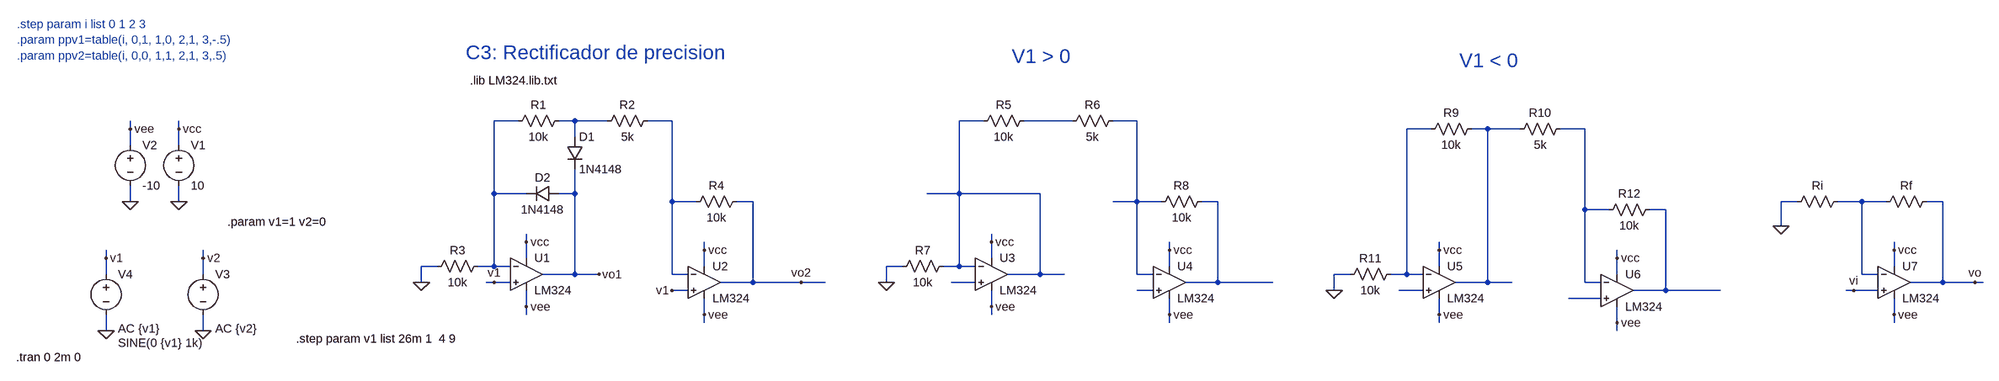
[diagram p0: schematic c3Rectificador.asc]
c3Rectificador.asc, the LTspice schematic file:
Version 4
SHEET 1 3476 680
WIRE 352 -240 304 -240
WIRE 464 -240 432 -240
WIRE 528 -240 464 -240
WIRE 656 -240 608 -240
WIRE 1296 -240 1248 -240
WIRE 1472 -240 1376 -240
WIRE 1600 -240 1552 -240
WIRE -416 -224 -416 -240
WIRE -320 -224 -320 -240
WIRE 2272 -224 2224 -224
WIRE 2384 -224 2352 -224
WIRE 2448 -224 2384 -224
WIRE 2576 -224 2528 -224
WIRE 464 -208 464 -240
WIRE -416 -192 -416 -224
WIRE -320 -192 -320 -224
WIRE 304 -96 304 -240
WIRE 368 -96 304 -96
WIRE 464 -96 464 -144
WIRE 464 -96 432 -96
WIRE 1248 -96 1248 -240
WIRE 1248 -96 1184 -96
WIRE 1408 -96 1248 -96
WIRE -416 -80 -416 -112
WIRE -320 -80 -320 -112
WIRE 656 -80 656 -240
WIRE 704 -80 656 -80
WIRE 816 -80 784 -80
WIRE 1600 -80 1600 -240
WIRE 1600 -80 1552 -80
WIRE 1648 -80 1600 -80
WIRE 1760 -80 1728 -80
WIRE 3040 -80 3008 -80
WIRE 3168 -80 3120 -80
WIRE 3216 -80 3168 -80
WIRE 3328 -80 3296 -80
WIRE 2576 -64 2576 -224
WIRE 2624 -64 2576 -64
WIRE 2736 -64 2704 -64
WIRE 3008 -32 3008 -80
WIRE 368 0 368 -16
WIRE 1312 0 1312 -16
WIRE 720 16 720 0
WIRE 1664 16 1664 0
WIRE 2288 16 2288 0
WIRE 3232 16 3232 0
WIRE -464 32 -464 16
WIRE -272 32 -272 16
WIRE 368 32 368 0
WIRE 1312 32 1312 0
WIRE 2640 32 2640 16
WIRE 192 48 160 48
WIRE 304 48 304 -96
WIRE 304 48 272 48
WIRE 336 48 304 48
WIRE 720 48 720 16
WIRE 1136 48 1104 48
WIRE 1248 48 1248 -96
WIRE 1248 48 1216 48
WIRE 1280 48 1248 48
WIRE 1664 48 1664 16
WIRE 2288 48 2288 16
WIRE 3232 48 3232 16
WIRE -464 64 -464 32
WIRE -272 64 -272 32
WIRE 464 64 464 -96
WIRE 464 64 400 64
WIRE 512 64 464 64
WIRE 656 64 656 -80
WIRE 688 64 656 64
WIRE 1408 64 1408 -96
WIRE 1408 64 1344 64
WIRE 1456 64 1408 64
WIRE 1600 64 1600 -80
WIRE 1632 64 1600 64
WIRE 2112 64 2080 64
WIRE 2224 64 2224 -224
WIRE 2224 64 2192 64
WIRE 2256 64 2224 64
WIRE 2640 64 2640 32
WIRE 3168 64 3168 -80
WIRE 3200 64 3168 64
WIRE 160 80 160 48
WIRE 304 80 288 80
WIRE 336 80 304 80
WIRE 816 80 816 -80
WIRE 816 80 752 80
WIRE 912 80 816 80
WIRE 960 80 912 80
WIRE 1104 80 1104 48
WIRE 1280 80 1232 80
WIRE 1760 80 1760 -80
WIRE 1760 80 1696 80
WIRE 1872 80 1760 80
WIRE 2384 80 2384 -224
WIRE 2384 80 2320 80
WIRE 2432 80 2384 80
WIRE 2576 80 2576 -64
WIRE 2608 80 2576 80
WIRE 3328 80 3328 -80
WIRE 3328 80 3264 80
WIRE 3392 80 3328 80
WIRE 3408 80 3392 80
WIRE 688 96 656 96
WIRE 1632 96 1600 96
WIRE 2080 96 2080 64
WIRE 2256 96 2208 96
WIRE 2736 96 2736 -64
WIRE 2736 96 2672 96
WIRE 2880 96 2736 96
WIRE 3152 96 3136 96
WIRE 3200 96 3152 96
WIRE 2608 112 2544 112
WIRE 368 128 368 96
WIRE 1312 128 1312 96
WIRE 368 144 368 128
WIRE 720 144 720 112
WIRE 1312 144 1312 128
WIRE 1664 144 1664 112
WIRE 2288 144 2288 112
WIRE 3232 144 3232 112
WIRE 720 160 720 144
WIRE 1664 160 1664 144
WIRE 2288 160 2288 144
WIRE 2640 160 2640 128
WIRE 3232 160 3232 144
WIRE -464 176 -464 144
WIRE -272 176 -272 144
WIRE 2640 176 2640 160
FLAG -320 -80 0
FLAG -320 -224 vcc
FLAG -416 -80 0
FLAG -416 -224 vee
FLAG -272 176 0
FLAG -272 32 v2
FLAG -464 176 0
FLAG -464 32 v1
FLAG 368 128 vee
FLAG 368 0 vcc
FLAG 160 80 0
FLAG 720 144 vee
FLAG 720 16 vcc
FLAG 912 80 vo2
FLAG 512 64 vo1
FLAG 1312 128 vee
FLAG 1312 0 vcc
FLAG 1104 80 0
FLAG 1664 144 vee
FLAG 1664 16 vcc
FLAG 2288 144 vee
FLAG 2288 16 vcc
FLAG 2080 96 0
FLAG 2640 160 vee
FLAG 2640 32 vcc
FLAG 304 80 v1
FLAG 656 96 v1
FLAG 3232 144 vee
FLAG 3232 16 vcc
FLAG 3008 -32 0
FLAG 3152 96 vi
FLAG 3392 80 vo
SYMBOL voltage -320 -208 R0
WINDOW 123 0 0 Left 0
WINDOW 39 0 0 Left 0
SYMATTR InstName V1
SYMATTR Value 10
SYMBOL voltage -416 -208 R0
WINDOW 123 0 0 Left 0
WINDOW 39 0 0 Left 0
SYMATTR InstName V2
SYMATTR Value -10
SYMBOL voltage -272 48 R0
WINDOW 123 24 124 Left 2
WINDOW 39 0 0 Left 0
SYMATTR Value2 AC {v2}
SYMATTR InstName V3
SYMATTR Value ""
SYMBOL voltage -464 48 R0
WINDOW 123 24 124 Left 2
WINDOW 39 0 0 Left 0
WINDOW 3 24 152 Left 2
SYMATTR Value2 AC {v1}
SYMATTR InstName V4
SYMATTR Value SINE(0 {v1} 1k)
SYMBOL diode 448 -208 R0
SYMATTR InstName D1
SYMATTR Value 1N4148
SYMBOL diode 432 -112 R90
WINDOW 0 0 32 VBottom 2
WINDOW 3 32 32 VTop 2
SYMATTR InstName D2
SYMATTR Value 1N4148
SYMBOL OpAmps\\opamp2 368 0 R0
SYMATTR InstName U1
SYMATTR Value LM324
SYMBOL OpAmps\\opamp2 720 16 R0
SYMATTR InstName U2
SYMATTR Value LM324
SYMBOL res 448 -256 R90
WINDOW 0 0 56 VBottom 2
WINDOW 3 32 56 VTop 2
SYMATTR InstName R1
SYMATTR Value 10k
SYMBOL res 624 -256 R90
WINDOW 0 0 56 VBottom 2
WINDOW 3 32 56 VTop 2
SYMATTR InstName R2
SYMATTR Value 5k
SYMBOL res 288 32 R90
WINDOW 0 0 56 VBottom 2
WINDOW 3 32 56 VTop 2
SYMATTR InstName R3
SYMATTR Value 10k
SYMBOL res 800 -96 R90
WINDOW 0 0 56 VBottom 2
WINDOW 3 32 56 VTop 2
SYMATTR InstName R4
SYMATTR Value 10k
SYMBOL OpAmps\\opamp2 1312 0 R0
SYMATTR InstName U3
SYMATTR Value LM324
SYMBOL OpAmps\\opamp2 1664 16 R0
SYMATTR InstName U4
SYMATTR Value LM324
SYMBOL res 1392 -256 R90
WINDOW 0 0 56 VBottom 2
WINDOW 3 32 56 VTop 2
SYMATTR InstName R5
SYMATTR Value 10k
SYMBOL res 1568 -256 R90
WINDOW 0 0 56 VBottom 2
WINDOW 3 32 56 VTop 2
SYMATTR InstName R6
SYMATTR Value 5k
SYMBOL res 1232 32 R90
WINDOW 0 0 56 VBottom 2
WINDOW 3 32 56 VTop 2
SYMATTR InstName R7
SYMATTR Value 10k
SYMBOL res 1744 -96 R90
WINDOW 0 0 56 VBottom 2
WINDOW 3 32 56 VTop 2
SYMATTR InstName R8
SYMATTR Value 10k
SYMBOL OpAmps\\opamp2 2288 16 R0
SYMATTR InstName U5
SYMATTR Value LM324
SYMBOL OpAmps\\opamp2 2640 32 R0
SYMATTR InstName U6
SYMATTR Value LM324
SYMBOL res 2368 -240 R90
WINDOW 0 0 56 VBottom 2
WINDOW 3 32 56 VTop 2
SYMATTR InstName R9
SYMATTR Value 10k
SYMBOL res 2544 -240 R90
WINDOW 0 0 56 VBottom 2
WINDOW 3 32 56 VTop 2
SYMATTR InstName R10
SYMATTR Value 5k
SYMBOL res 2208 48 R90
WINDOW 0 0 56 VBottom 2
WINDOW 3 32 56 VTop 2
SYMATTR InstName R11
SYMATTR Value 10k
SYMBOL res 2720 -80 R90
WINDOW 0 0 56 VBottom 2
WINDOW 3 32 56 VTop 2
SYMATTR InstName R12
SYMATTR Value 10k
SYMBOL OpAmps\\opamp2 3232 16 R0
SYMATTR InstName U7
SYMATTR Value LM324
SYMBOL res 3136 -96 R90
WINDOW 0 0 56 VBottom 2
WINDOW 3 32 56 Invisible 2
SYMATTR InstName Ri
SYMATTR Value 5k
SYMBOL res 3312 -96 R90
WINDOW 0 0 56 VBottom 2
WINDOW 3 32 56 Invisible 2
SYMATTR InstName Rf
SYMATTR Value 10k
TEXT -224 -40 Left 2 !.param v1=1 v2=0
TEXT -640 -432 Left 2 ;.step param i list 0 1 2 3\n.param ppv1=table(i, 0,1, 1,0, 2,1, 3,-.5)\n.param ppv2=table(i, 0,0, 1,1, 2,1, 3,.5)
TEXT 256 -320 Left 2 !.lib LM324.lib.txt
TEXT 248 -376 Left 4 ;C3: Rectificador de precision
TEXT 1352 -368 Left 4 ;V1 > 0
TEXT 2328 -360 Left 4 ;V1 < 0
TEXT -88 192 Left 2 !.step param v1 list 26m 1  4 9
TEXT -642 228 Left 2 !.tran 0 2m 0

The netlist it stands for:
* c3Rectificador.asc
V1 vcc 0 10
V2 vee 0 -10
V3 v2 0 AC {v2}
V4 v1 0 SINE(0 {v1} 1k) AC {v1}
D1 N002 vo1 1N4148
D2 vo1 N001 1N4148
XU1 v1 N001 vcc vee vo1 LM324  ; pins In+ In- V+ V- OUT
XU2 v1 N003 vcc vee vo2 LM324  ; pins In+ In- V+ V- OUT
R1 N002 N001 10k
R2 N003 N002 5k
R3 N001 0 10k
R4 vo2 N003 10k
XU3 N013 N004 vcc vee N004 LM324  ; pins In+ In- V+ V- OUT
XU4 N014 N006 vcc vee N010 LM324  ; pins In+ In- V+ V- OUT
R5 N005 N004 10k
R6 N006 N005 5k
R7 N004 0 10k
R8 N010 N006 10k
XU5 N015 N007 vcc vee N008 LM324  ; pins In+ In- V+ V- OUT
XU6 N016 N009 vcc vee N012 LM324  ; pins In+ In- V+ V- OUT
R9 N008 N007 10k
R10 N009 N008 5k
R11 N007 0 10k
R12 N012 N009 10k
XU7 vi N011 vcc vee vo LM324  ; pins In+ In- V+ V- OUT
Ri N011 0 5k
Rf vo N011 10k
.model D D
.lib standard.dio
.param v1=1 v2=0
* .step param i list 0 1 2 3
* .param ppv1=table(i, 0,1, 1,0, 2,1, 3,-.5)
* .param ppv2=table(i, 0,0, 1,1, 2,1, 3,.5)
.lib LM324.lib.txt
* C3: Rectificador de precision
* V1 > 0
* V1 < 0
.step param v1 list 26m 1  4 9
.tran 0 2m 0
.backanno
.end